# EAGLE design Buck Converter (EAGLE 8.4.3)
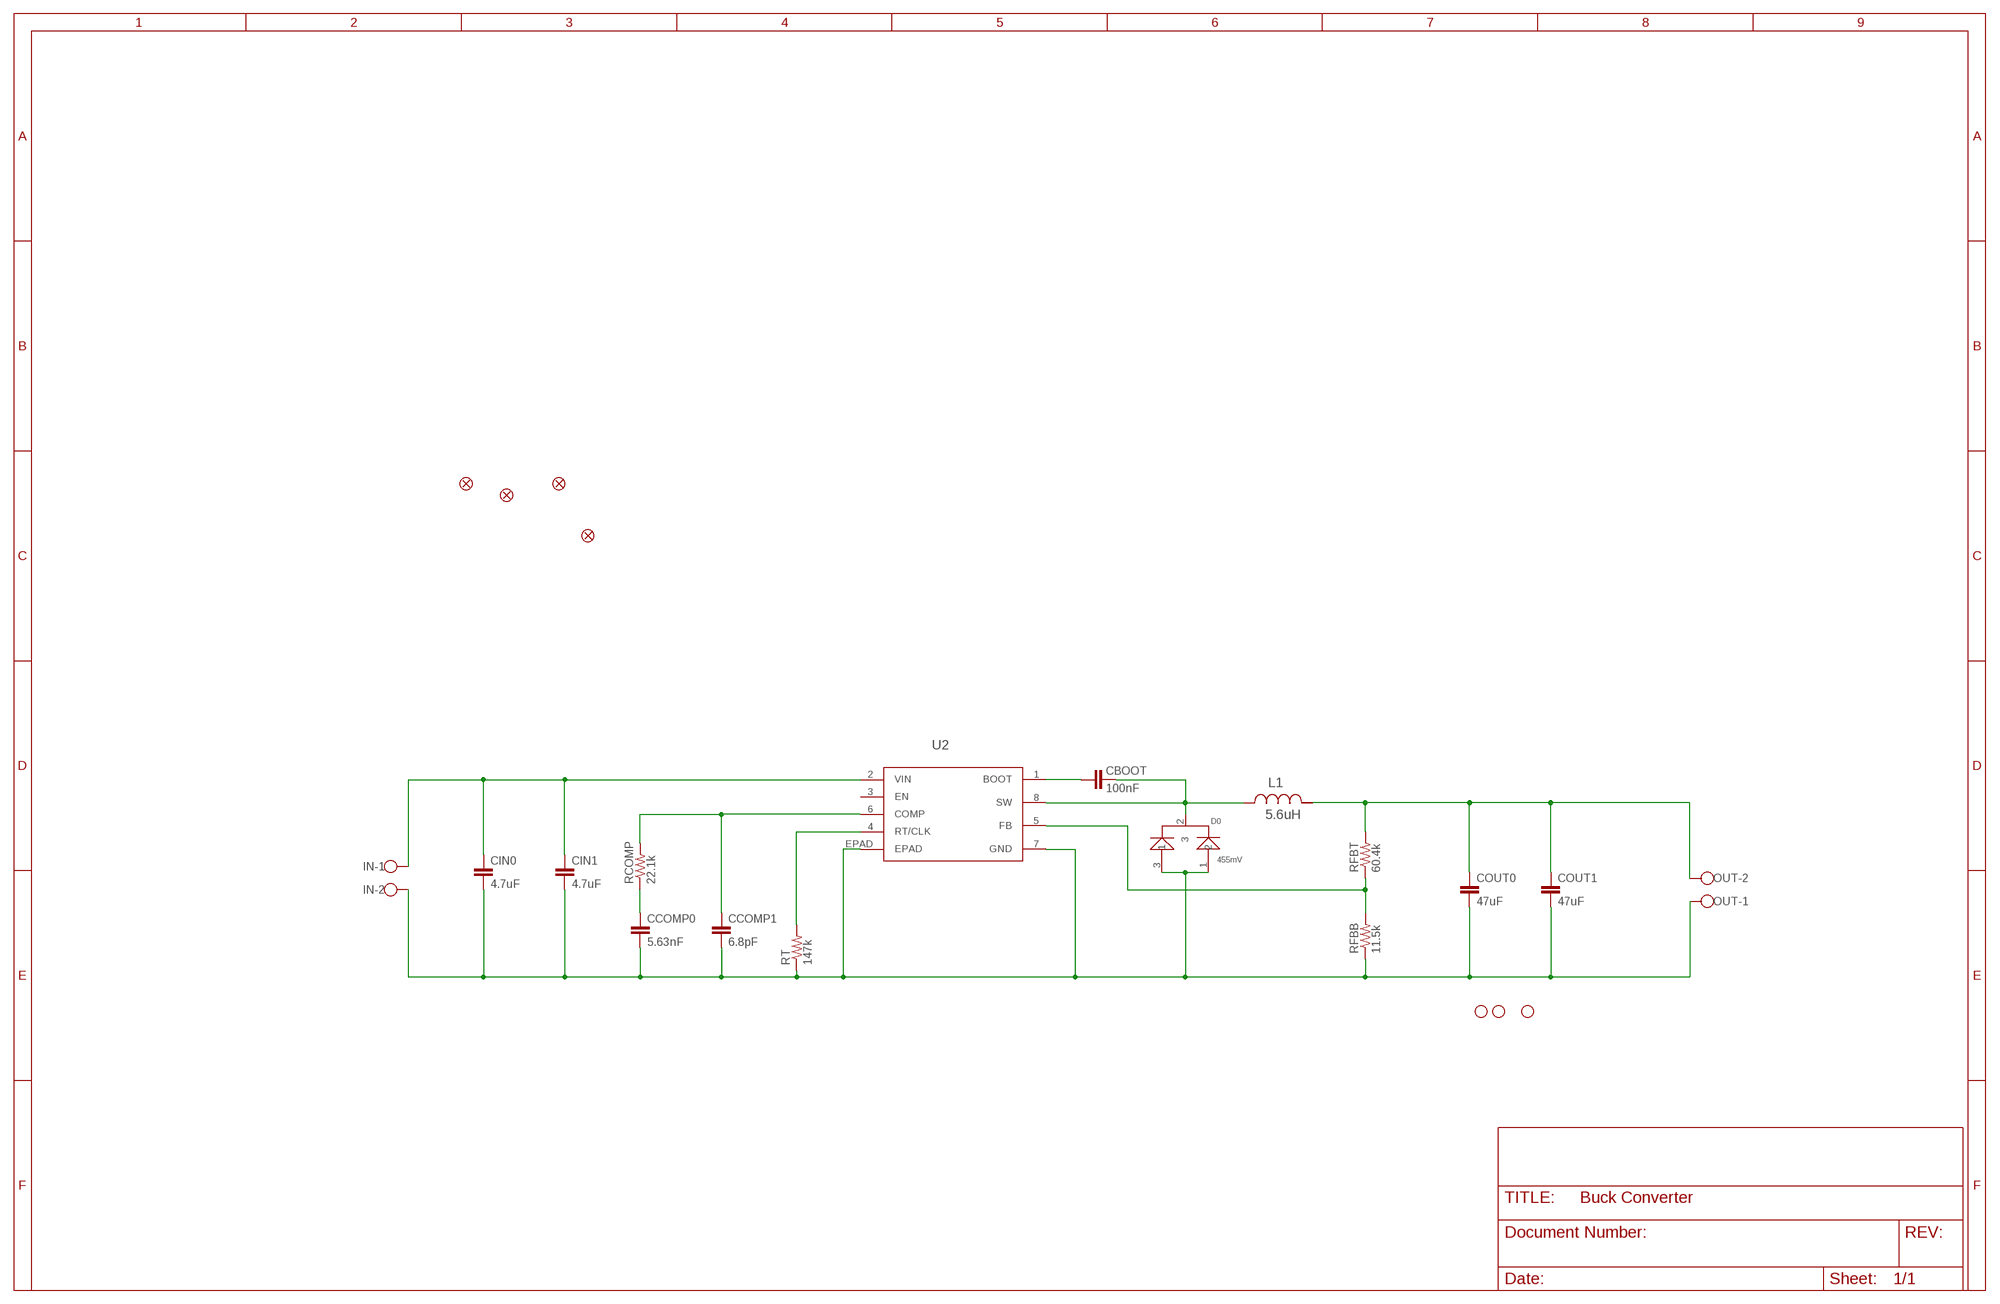
[diagram p0: schematic, sheet 1]

## Parts
CBOOT  100nF  C-EUC0805  [C0805]
CCOMP0  5.63nF  C-EUC0805  [C0805]
CCOMP1  6.8pF  C-EUC0805  [C0805]
CIN0  4.7uF  C-EUC0805  [C0805]
CIN1  4.7uF  C-EUC0805  [C0805]
COUT0  47uF  C-EUC1206  [C1206]
COUT1  47uF  C-EUC1206  [C1206]
D0  455mV  STPS20M100SG-TRD2PAK-L  [D2PAK-L]
FD1  FIDUCIALUFIDUCIAL  [FIDUCIAL-MICRO]
FD2  FIDUCIALUFIDUCIAL  [FIDUCIAL-MICRO]
FD3  FIDUCIALUFIDUCIAL  [FIDUCIAL-MICRO]
FD4  FIDUCIALUFIDUCIAL  [FIDUCIAL-MICRO]
H1  STAND-OFFTIGHT  [STAND-OFF-TIGHT]
H2  STAND-OFFTIGHT  [STAND-OFF-TIGHT]
H3  STAND-OFFTIGHT  [STAND-OFF-TIGHT]
IN  W237-102  [W237-102]
L1  5.6uH  SDR1307-5R6ML  [SDR1307]
OUT  W237-102  [W237-102]
RCOMP  22.1k  R-US_R0603  [R0603]
RFBB  11.5k  R-US_R0603  [R0603]
RFBT  60.4k  R-US_R0603  [R0603]
RT  147k  R-US_R0603  [R0603]
U2  TPS54540DDARDDA8_3P1X2P4-L  [DDA8_3P1X2P4-L]

## Nets
COMP: CCOMP1.1 RCOMP.2 U2.6(COMP)
FB: RFBB.2 RFBT.1 U2.5(FB)
GND: CCOMP0.2 CCOMP1.2 CIN0.2 CIN1.2 COUT0.2 COUT1.2 D0.1 D0.3 IN.2 OUT.1 RFBB.1 RT.1 U2.7(GND) U2.EPAD
N$2: CBOOT.2 U2.1(BOOT)
N$4: CCOMP0.1 RCOMP.1
RT_CLK: RT.2 U2.4(RT/CLK)
SW: CBOOT.1 D0.2 L1.1 U2.8(SW)
VIN: CIN0.1 CIN1.1 IN.1 U2.2(VIN)
VOUT: COUT0.1 COUT1.1 L1.2 OUT.2 RFBT.2
Unconnected: U2.3(EN)

## Library data of the parts
CBOOT CCOMP0 CCOMP1 = resistor:C-EU: CAPACITOR, European symbol
CIN0 CIN1 COUT0 COUT1 = rcl:C-EU: CAPACITOR, European symbol
D0 = STPS20M100S_LIB:STPS20M100SG-TR; MANUFACTURER_PART_NUMBER: STPS20M100SGTR; VENDOR: ST Microelectronics
FD1-FD4 = SparkFun-Aesthetics:FIDUCIAL: Fiducial Alignment Points Point-of-reference for pick-and-place machines and other optical instruments.
H1-H3 = SparkFun-Hardware:STAND-OFF: Stand Off Drill holes for mechanically mounting via screws, standoffs, etc. Note: Use the keepout ring to avoid running the screw head into surrounding components. Variant Overviews STAND-OFF - Mechanical footprint for a #4 phillips button head screw. STAND-OFF-TIGHT - Mechanical footprint for a #4 phillips button head screw, Example SparkFun Products Screw - Phillips Head (1/4", 4-40, 10 pack) <https://www.sparkfun.com/products/10453> (PRT-10453) Screw - Phillips Head (1/2", 4-40, 10 pack) <https://www.sparkfun.com/products/10452> (PRT-10452) Screw - Phillips Head (3/4", 4-40, 10 pack) <https://www.sparkfun.com/products/10451> (PRT-10451) Screw - Phillips Head (1", 4-40, 10 pack) <https://www.sparkfun.com/products/10450> (PRT-10450)
IN OUT = con-wago-500:W237-102: WAGO SCREW CLAMP; MPN: 237-102; OC_FARNELL: unknown; OC_NEWARK: 70K9898
L1 = sendes:SDR1307-5R6ML; DCR: 0.015; IDC: 6.5; L: 5.6E6; MANUFACTURER_NAME: Bourns; MANUFACTURER_PART_NUMBER: SDR13075R6ML; VENDOR: Bourns
RCOMP RFBB RFBT RT = resistor:R-US_: RESISTOR, American symbol
U2 = TPS54540_lib:TPS54540DDAR; MANUFACTURER_PART_NUMBER: TPS54540DDAR; VENDOR: Texas Instruments

## Board
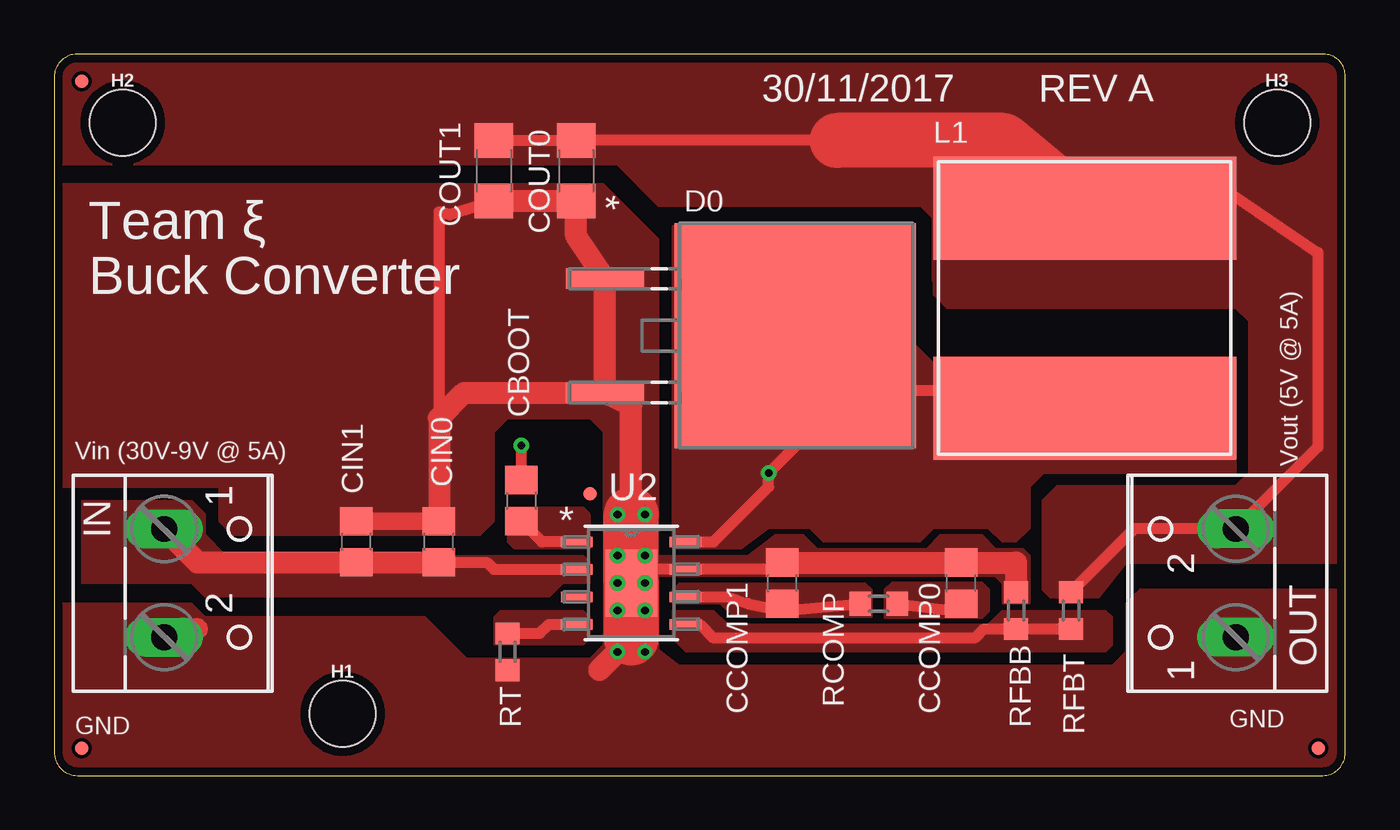
[diagram p1: board, top side]
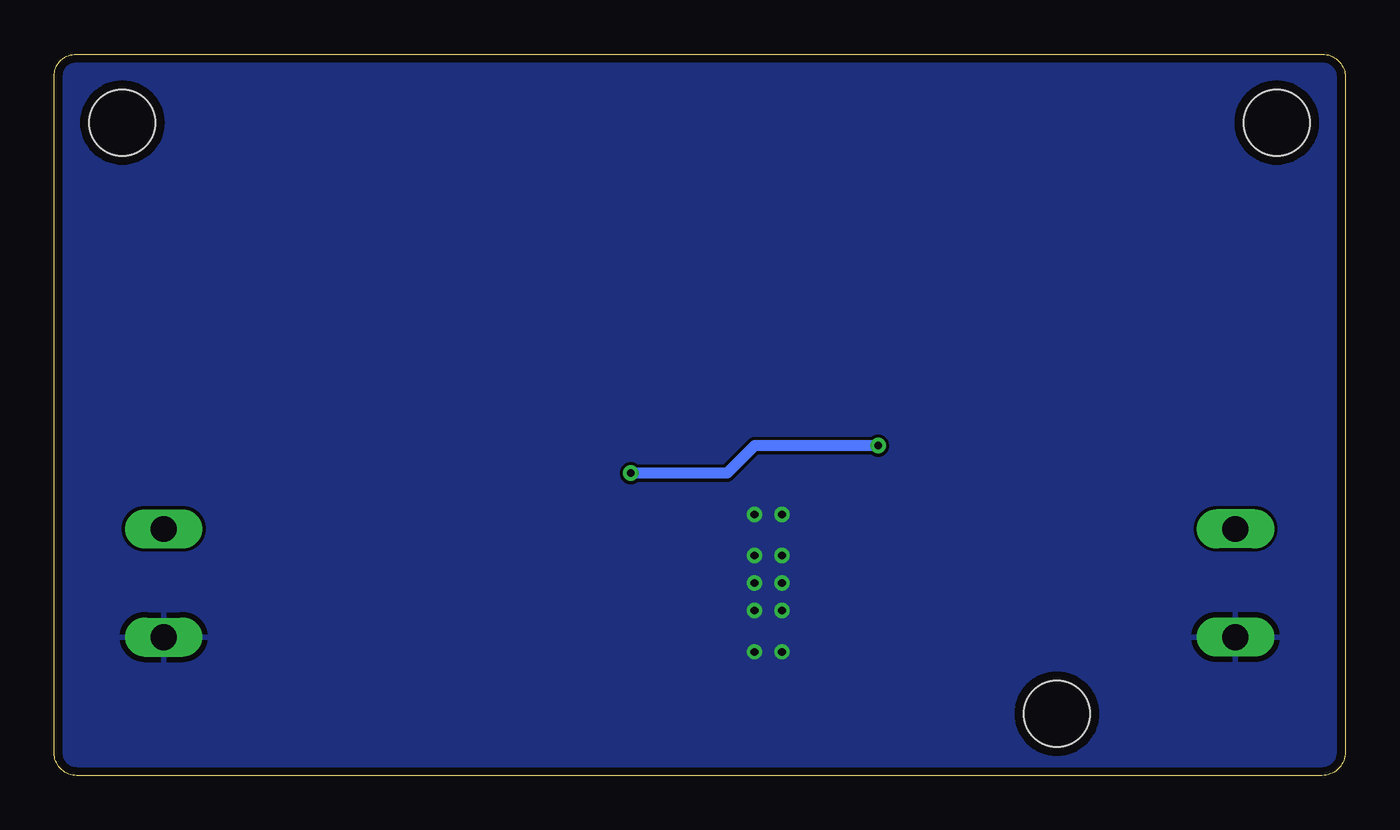
[diagram p2: board, bottom side, seen from below]

Size 59.67 x 33.33 mm. Coordinates in mm from the lower left corner, seen from the top.
Outline: 0,32.26 0,1.08 arc90 1.08,0 58.62,0 arc90 59.67,1.05 59.67,32.3 arc90 58.64,33.33 1.06,33.33 arc90 0,32.26
Copper layers (1*16): Top 0.0356mm / dielectric 1.5011mm / Bottom 0.0356mm
Design rules "LaenPCBOrder": minimum track width 6mil, minimum drill 13mil, track to track 6mil, track to pad 6mil, pad to pad 6mil, via to via 6mil, smd to smd 6mil, copper to edge 15mil, drill to drill 6mil, minimum pad ring 7mil, minimum via ring 7mil, stop-mask expansion 3mil, vias tented up to drill 0mil, thermal gap 10mil

### Footprints (pad centres in the part's own frame; a part is rotated, then mirrored left to right if it is on the bottom)
C0805 = smd 1.3 x 1.5: 1 -0.95,0; 2 0.95,0
C1206 = smd 1.6 x 1.8: 1 -1.4,0; 2 1.4,0
D2PAK-L = smd 0.94 x 3.607: 1 -2.64,-8.826; 3 2.64,-8.826 | smd 10.389 x 11.151: 2 0,-0.051
FIDUCIAL-MICRO = smd 0.635 x 0.635: 1 0,0
STAND-OFF-TIGHT = hole 3.048: 0,0
W237-102 = drill 1.194 long: 1 -2.5,-1.27; 2 2.5,-1.27
SDR1307 = smd 4.75 x 13.995: 1 -4.623,0; 2 4.623,0
R0603 = smd 1 x 1.1: 1 -0.85,0; 2 0.85,0
DDA8_3P1X2P4-L = smd 1.473 x 0.483: 1 -2.515,1.905; 2 -2.515,0.635; 3 -2.515,-0.635; 4 -2.515,-1.905; 5 2.515,-1.905; 6 2.515,-0.635; 7 2.515,0.635; 8 2.515,1.905 | smd 2.4 x 3.1: EPAD 0,0

### Placement (x,y rotation side)
CBOOT  21.59,12.7 270 top
CCOMP0  41.91,8.89 90 top
CCOMP1  33.66,8.89 90 top
CIN0  17.78,10.79 90 top
CIN1  13.97,10.79 90 top
COUT0  24.13,27.94 270 top
COUT1  20.32,27.94 270 top
D0  34.29,20.32 270 top
FD1  1.27,1.27 0 top
FD2  1.27,32.07 0 top
FD3  58.42,1.27 0 top
FD4  24.77,13.02 0 top
H1  13.34,2.86 0 top
H2  3.17,30.16 0 top
H3  56.52,30.16 0 top
IN  6.35,8.89 270 top
L1  47.62,21.59 90 top
OUT  53.34,8.89 90 top
RCOMP  38.1,7.94 180 top
RFBB  44.45,7.62 270 top
RFBT  46.99,7.62 90 top
RT  20.95,5.71 90 top
U2  26.67,8.89 0 top

### Tracks (layer width: path | path; a pad name or v marks a point on that pad's centre or on a via)
COMP
  Top 0.508: 33.66,7.62 RCOMP.2 | 33.66,7.62 CCOMP1.1 | U2.6 31.11,8.26 32.07,7.94 33.66,7.62
  pour Top (no thermals): 28.57,7.94 28.57,8.57 28.89,8.89 37.47,8.89 37.78,8.57 37.78,7.3 31.43,7.3 30.8,7.94
FB
  Top 0.508: U2.5 29.84,6.99 30.48,6.35 42.55,6.35 42.97,6.77 RFBB.2 RFBT.1
  pour Top (no thermals): 43.81,7.62 48.58,7.62 48.9,7.3 48.9,6.03 48.58,5.71 29.21,5.71 28.57,6.35 28.57,7.62 30.48,7.62 31.11,6.99 43.18,6.99
GND  (via drill 0.35, 0.35 pad 0.55)
  Top 0.508: CCOMP1.2 33.34,9.53 U2.7 27.3,9.53 U2.EPAD | COUT1.2 18.29,25.91 17.78,26.04 17.78,16.51
  Top 0.813: CIN1.2 CIN0.2
  Top 1.016: D0.3 D0.1 24.13,24.93 COUT0.2 COUT1.2 | CCOMP1.2 CCOMP0.2 44.45,9.84 RFBB.1 | 26.67,6.35 v26.04,5.71 25.18,4.87 | 26.67,12.06 26.67,17.11 D0.3 | CIN0.2 17.78,16.51 18.95,17.68 D0.3 | 6.61,6.77 IN.2
  Top 2.54: 26.67,12.06 U2.EPAD 26.67,6.35
  other vias: 26.04,10.16 27.3,10.16 26.04,8.89 27.3,8.89 26.04,7.62 27.3,7.62 27.3,12.06 26.04,12.06 27.3,5.71
  pour Top (no thermals): 0,7.94 0,1.08 arc90 1.08,0 27.94,0 27.94,24.77 25.4,27.3 0,27.3 0,13.34 7.62,13.34 7.62,11.75 8.26,11.11 19.68,11.11 20.32,11.75 20.32,15.88 20.95,16.51 24.77,16.51 25.4,15.88 25.4,6.03 24.77,5.4 19.05,5.4 17.14,7.3 6.99,7.3 6.35,7.94
  pour Top (no thermals): 27.94,1.27 27.94,0 58.61,0 arc90 59.69,1.08 59.69,8.57 50.16,8.57 49.53,7.94 49.53,5.71 48.9,5.08 26.67,5.08 26.67,1.27
  pour Bottom: 1.08,33.33 58.61,33.34 arc-90 59.69,32.25 59.69,1.08 arc-90 58.61,0 1.08,0 arc-90 0,1.08 0,32.26 arc-90
  pour Top (no thermals): 27.94,9.21 43.5,9.21 43.81,8.89 43.81,7.94 45.09,7.94 45.09,10.16 44.77,10.48 43.5,10.48 42.86,11.11 40.96,11.11 40.32,10.48 35.24,10.48 34.61,11.11 33.34,11.11 32.07,10.16 27.94,10.16
  pour Top (no thermals): 27.62,6.03 28.89,5.08 28.89,4.13 28.57,3.81 27.3,3.81 26.99,4.13 26.99,5.4
N$2
  Top 0.508: U2.1 22.55,10.79 CBOOT.2
  pour Top (no thermals): 24.77,10.48 24.77,12.06 24.45,12.38 20.95,12.38 20.95,10.79 21.27,10.48
N$4
  Top 0.508: RCOMP.1 41.59,7.62 arc90 CCOMP0.1
  pour Top (no thermals): 38.42,7.3 38.42,8.57 38.73,8.89 42.86,8.89 43.18,8.57 43.18,7.62 42.86,7.3
RT_CLK
  Top 0.508: U2.4 22.86,6.99 22.44,6.57 RT.2
  pour Top (no thermals): 20.32,6.03 24.45,6.03 24.77,6.35 24.77,7.3 24.45,7.62 20.64,7.62 20.32,7.3
SW  (via drill 0.35 pad 0.55)
  Top 0.508: CBOOT.1 v21.59,15.24 | 34.87,17.78 34.87,15.82 v33.02,13.97 33.02,13.34 30.48,10.79 U2.8 | 34.87,17.78 D0.2 | L1.1 49.35,17.78 34.87,17.78
  Bottom 0.508: v21.59,15.24 27.3,15.24 28.57,13.97 v33.02,13.97
  pour Top (no thermals): 28.57,10.48 31.75,10.48 33.02,11.43 34.92,11.43 35.56,10.79 40.01,10.79 40.64,11.43 43.18,11.43 43.81,10.79 44.45,10.79 45.09,11.43 45.09,13.34 45.72,13.97 54.61,13.97 54.51,18.75 53.35,19.05 40.64,19.05 39.37,20.32 39.37,25.4 28.57,25.4
VIN
  Top 0.508: CIN0.1 20,9.85 20.32,9.53 U2.2
  Top 1.016: IN.1 6.62,9.85 CIN1.1 CIN0.1
  pour Top (no thermals): 6.35,8.89 1.27,8.89 1.27,12.7 2.54,12.7 6.35,12.7 6.99,12.06 6.99,11.11 7.94,10.16 10.16,10.16 24.13,10.16 24.45,10.16 24.77,9.84 24.77,9.53 24.77,8.89 23.5,8.89 22.86,8.26 6.99,8.26
VOUT
  Top 0.508: COUT1.1 COUT0.1 36.2,29.34 | L1.2 54.43,26.85 58.4,24.15 58.4,15.18 OUT.2 49.91,11.39 RFBT.2
  Top 2.54: L1.2 43.86,29.34 36.2,29.34
  pour Top (no thermals): 54.61,13.34 46.35,13.34 45.72,12.7 45.72,8.57 46.04,8.26 48.26,8.26 49.53,9.84 59.37,9.84 59.69,32.25 arc90 58.61,33.34 1.08,33.34 arc90 0,32.25 -0.32,28.26 26.04,28.26 27.94,26.35 40.64,26.35 40.64,22.86 55.24,22.86 55.24,13.97
  pour Top (no thermals): 55.24,13.97 55.24,20.95 54.61,21.59 41.27,21.59 40.64,22.23 40.64,25.72 40.01,26.35 27.94,26.35 29.21,27.94 53.98,27.94 57.15,24.77 57.78,23.5 57.78,13.97

### Text on the board
tNames: 30/11/2017 REV A | Team ξ | Buck Converter | Vin (30V-9V @ 5A) | Vout (5V @ 5A) | GND | GND